# EAGLE design charger (EAGLE 9.6.1)
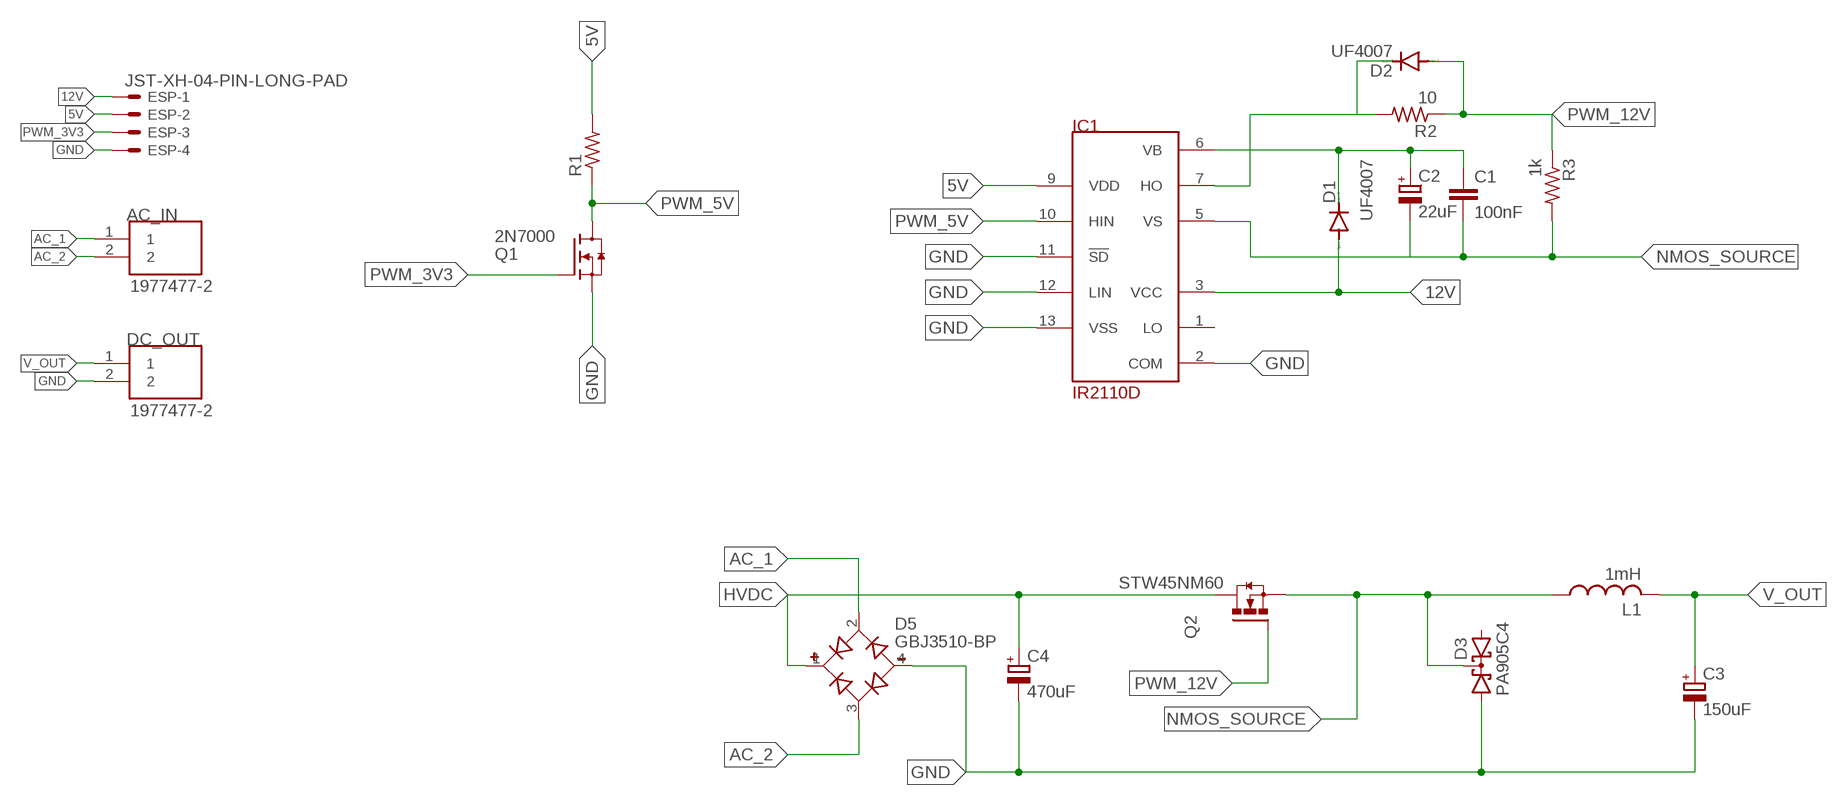
[diagram p0: schematic, sheet 1]

## Parts
AC_IN  1977477-2  [TE_1977477-2]
C1  100nF  C-EU025-025X050  [C025-025X050]
C2  22uF  CPOL-EUE2,5-6E  [E2,5-6E]
C3  150uF  CPOL-EUE7.5-18  [E7,5-18]
C4  470uF  CPOL-EUE10-35  [EB35D]
D1  UF4007  BAS15  [DO34-7]
D2  UF4007  BAS15  [DO34-7]
D3  PA905C4  PBYR3035  [SOT93S]
D5  GBJ3510-BP  [DIOB_GBJ3510-BP]
DC_OUT  1977477-2  [TE_1977477-2]
ESP  JST-XH-04-PIN-LONG-PAD  [JST-XH-04-PACKAGE-LONG-PAD]
IC1  IR2110D  [DIL14]
L1  1mH  L-USTJ7-U1  [TJ7-U1]
Q1  2N7000  [TO92]
Q2  STW45NM60  IRFP240  [TO247AC]
R1  R-US_0204/7  [0204/7]
R2  10  R-US_0204/7  [0204/7]
R3  1k  R-US_0204/7  [0204/7]

## Nets
5V: ESP.2 IC1.9(VDD) R1.2
12V: D1.A ESP.1 IC1.3(VCC)
AC_1: AC_IN.1 D5.2(AC1)
AC_2: AC_IN.2 D5.3(AC2)
GND: C3.- C4.- D3.A1 D5.4(-) DC_OUT.2 ESP.4 IC1.2(COM) IC1.11(!SD) IC1.12(LIN) IC1.13(VSS) Q1.1(S)
HVDC: C4.+ D5.1(+) Q2.2(D)
N$2: D2.C IC1.7(HO) R2.2
NMOS_SOURCE: C1.2 C2.- D3.C IC1.5(VS) L1.1 Q2.3(S) R3.2
PWM_3V3: ESP.3 Q1.2(G)
PWM_5V: IC1.10(HIN) Q1.3(D) R1.1
PWM_12V: D2.A Q2.1(G) R2.1 R3.1
V_OUT: C3.+ DC_OUT.1 L1.2
VB: C1.1 C2.+ D1.C IC1.6(VB)
Unconnected: D3.A2 IC1.1(LO)

## Library data of the parts
AC_IN DC_OUT = terminal_block:1977477-2: Check availability <https://pricing.snapeda.com/parts/1977477-2/TE%20Connectivity/view-part?ref=eda>; AVAILABILITY: In Stock; COMMENT: 1977477-2; DESCRIPTION: Conn Barrier Strip 2 POS 8.25mm Solder ST Thru-Hole 15A/Contact Carton; MF: TE Connectivity; MP: 1977477-2; PACKAGE: None; PRICE: None; PURCHASE-URL: https://pricing.snapeda.com/search/part/1977477-2/?ref=eda
C1 = rcl:C-EU: CAPACITOR, European symbol; SPICEPREFIX: C
C2-C4 = rcl:CPOL-EU: POLARIZED CAPACITOR, European symbol; SPICEPREFIX: C
D1 D2 = diode:BAS15: DIODE high speed
D3 = diode:PBYR3035: Dual DIODE common cathode
D5 = GBJ3510-BP:GBJ3510-BP: Diode Rectifier Bridge Single 1KV 35A 4-Pin(4+Tab) Case GBJ Bulk/Tube Check availability <https://pricing.snapeda.com/parts/GBJ3510-BP/Micro%20Commercial/view-part?ref=eda>; AVAILABILITY: In Stock; DESCRIPTION: Bridge Rectifier Single Phase Standard 1 kV Through Hole GBJ; MF: Micro Commercial; MP: GBJ3510-BP; PACKAGE: SIP-4 Micro Commercial Co; PRICE: None; PURCHASE-URL: https://pricing.snapeda.com/search/part/GBJ3510-BP/?ref=eda
ESP = Rembrandt Electronics - JST XH Connectors v1-0:JST-XH-04-PIN: JST XH Connector 2 Pin Wire to board connector. Pitch: 2,54 mm, (0.100") Number of pins: 4 Created by Rembrandt Electronics www.rembrandtelectronics.com
IC1 = irs:IR2110
L1 = custom_inductor:L-US: INDUCTOR, American symbol; SPICEPREFIX: L
Q1 = 2N7000:2N7000: Check prices <https://pricing.snapeda.com/parts/2N7000/STMicroelectronics/view-part?ref=eda>; AVAILABILITY: In Stock; DESCRIPTION: N-Channel 60V 350mA (Tc) 1W (Tc) Through Hole TO-92-3; MF: STMicroelectronics; MP: 2N7000; PACKAGE: E-PKG AXIAL-LEADED-2 ON Semiconductor; PRICE: None
Q2 = IRFP240(TO-247):IRFP240: MOSFET N-CH 200V 20A TO-247AC Check availability <https://pricing.snapeda.com/parts/IRFP240/Vishay%20Siliconix/view-part?ref=eda>; AVAILABILITY: In Stock; DESCRIPTION: N-Channel 200 V 20A (Tc) 150W (Tc) Through Hole TO-247AC; MF: Vishay Siliconix; MP: IRFP240; PACKAGE: TO-247 Vishay Siliconix; PRICE: None
R1-R3 = rcl:R-US_: RESISTOR, American symbol; SPICEPREFIX: R

## Board
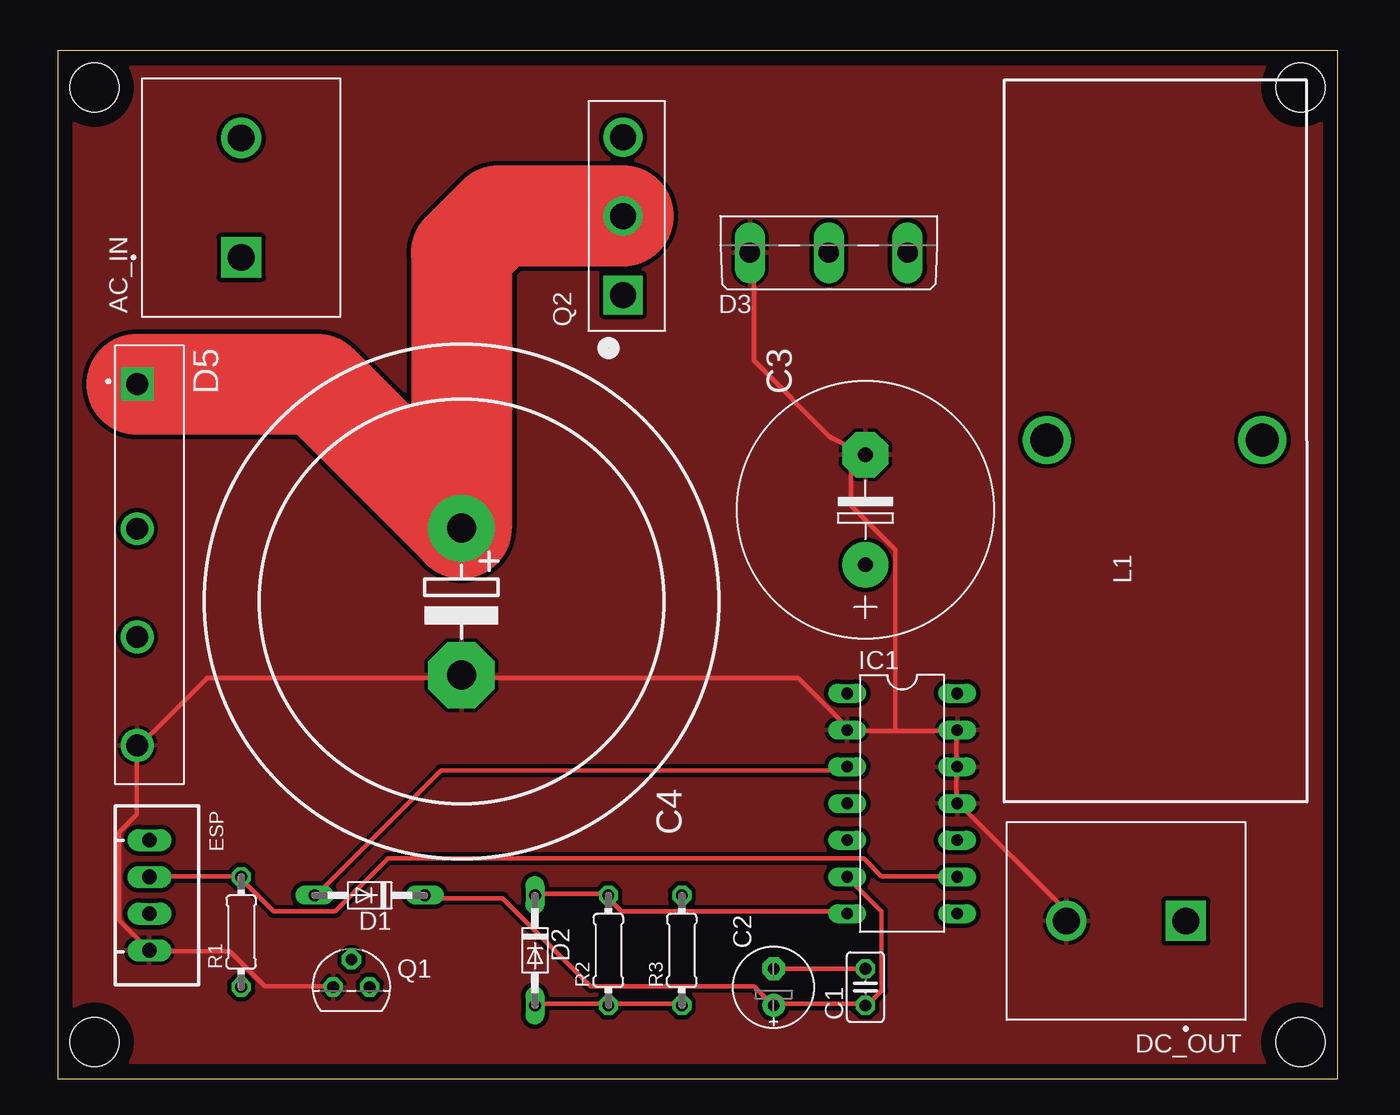
[diagram p1: board, top side]
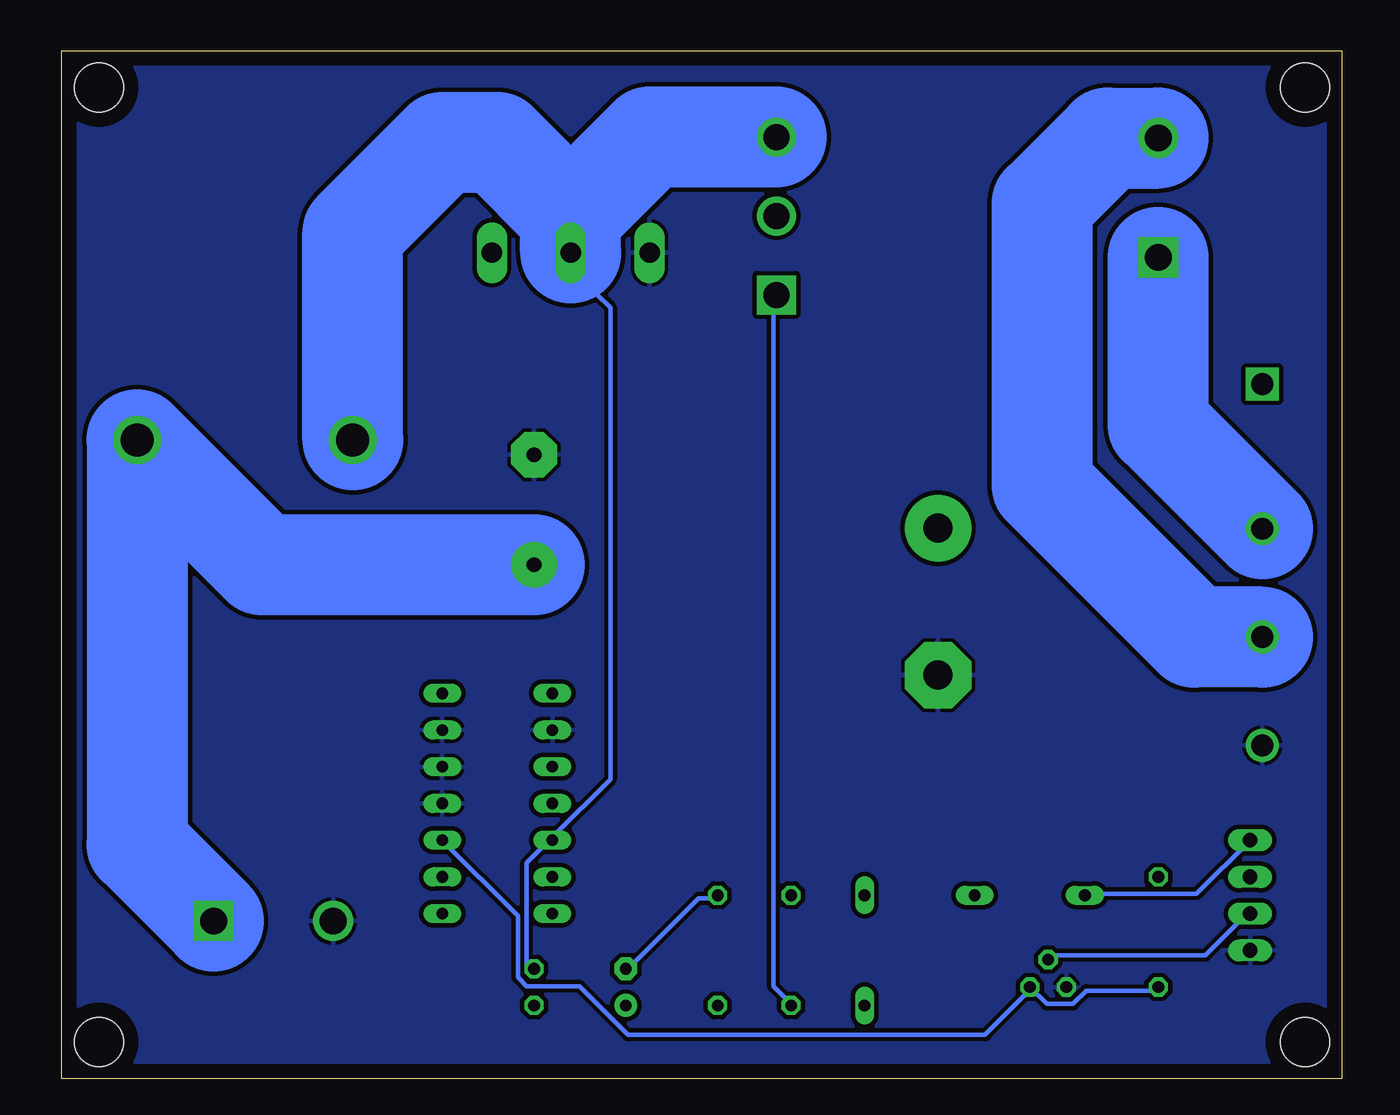
[diagram p2: board, bottom side, seen from below]

Size 88.57 x 71.11 mm. Coordinates in mm from the lower left corner, seen from the top.
Outline: 0,0 88.57,0 88.57,71.11 0,71.11 0,0
Copper layers (1*16): Top 0.035mm / dielectric 1.5mm / Bottom 0.035mm
Design rules "default *": minimum track width 12mil, minimum drill 0.35mm, track to track 12mil, track to pad 12mil, pad to pad 12mil, via to via 12mil, smd to smd 12mil, copper to edge 40mil, drill to drill 6mil, minimum pad ring 10mil, minimum via ring 8mil, stop-mask expansion 4mil, vias tented up to drill 0mil, thermal gap 10mil
Holes 3.4 mm at 2.54,68.58 85.98,68.58 2.54,2.54 85.98,2.54

### Footprints (pad centres in the part's own frame; a part is rotated, then mirrored left to right if it is on the bottom)
TE_1977477-2 = drill 1.85 square: 1 -4.13,0 | drill 1.85: 2 4.13,0
C025-025X050 = drill 0.813 octagon: 1 -1.27,0; 2 1.27,0
E2,5-6E = drill 0.813 pad 1.575: + -1.27,0 | drill 0.813 pad 1.575 octagon: - 1.27,0
E7,5-18 = drill 1.016 pad 3.15: + -3.81,0 | drill 1.016 pad 3.15 octagon: - 3.81,0
EB35D = drill 2.007 pad 4.597: + -5.08,0 | drill 2.007 pad 4.597 octagon: - 5.08,0
DO34-7 = drill 0.813 long: A 3.81,0; C -3.81,0
SOT93S = drill 1.397 long: A1 -5.461,-2.54; A2 5.461,-2.54; C 0,-2.54
DIOB_GBJ3510-BP = drill 1.51 pad 2.27 square: 1 -12.5,-0.85 | drill 1.51 pad 2.27: 2 -2.5,-0.85; 3 5,-0.85; 4 12.5,-0.85
JST-XH-04-PACKAGE-LONG-PAD = drill 1.016 long: 1 -3.81,0; 2 -1.27,0; 3 1.27,0; 4 3.81,0
DIL14 = drill 0.813 long: 1 -7.62,-3.81; 2 -5.08,-3.81; 3 -2.54,-3.81; 4 0,-3.81; 5 2.54,-3.81; 6 5.08,-3.81; 7 7.62,-3.81; 8 7.62,3.81; 9 5.08,3.81; 10 2.54,3.81; 11 0,3.81; 12 -2.54,3.81; 13 -5.08,3.81; 14 -7.62,3.81
TJ7-U1 = drill 2.286: 1 -6.503,4.826; 2 8.408,4.826
TO92 = drill 0.813 octagon: 1 -1.27,0; 2 0,1.905; 3 1.27,0
TO247AC = drill 1.79 pad 2.69 square: 1 -5.46,0.255 | drill 1.79 pad 2.69: 2 0,0.255; 3 5.46,0.255
0204/7 = drill 0.813 octagon: 1 -3.81,0; 2 3.81,0

### Placement (x,y rotation side)
AC_IN  12.7,60.96 90 top
C1  55.88,6.35 90 top
C2  49.53,6.35 90 top
C3  55.88,39.37 90 top
C4  27.94,33.02 270 top
D1  21.59,12.7 180 top
D2  33.02,8.89 270 top
D3  53.34,59.69 0 top
D5  6.35,35.56 270 top
DC_OUT  73.91,10.92 180 top
ESP  6.35,12.7 270 top
IC1  58.42,19.05 270 top
L1  74.93,39.37 0 top
Q1  20.32,6.35 0 top
Q2  39.37,59.69 90 top
R1  12.7,10.16 90 top
R2  38.1,8.89 90 top
R3  43.18,8.89 90 top

### Tracks (layer width: path | path; a pad name or v marks a point on that pad's centre or on a via)
5V
  Top 0.305: ESP.2 6.4,14.02 12.5,14.02 R1.2 12.8,13.72 14.94,11.58 19.2,11.58 22.86,15.24 55.78,15.24 57,14.02 62.18,14.02 IC1.9
12V
  Top 0.305: IC1.3 54.56,21.34 26.52,21.34 17.98,12.8 D1.A
  Bottom 0.305: ESP.1 10.06,12.8 17.68,12.8 D1.A
AC_1
  Bottom 6.985: D5.2 12.7,45.26 AC_IN.1
AC_2
  Bottom 6.985: D5.3 10.24,30.56 20.73,41.05 20.73,60.55 16.19,65.09 AC_IN.2
GND
  Top 0.305: Q1.1 18.9,6.4 14.33,6.4 11.89,8.84 6.4,8.84 ESP.4 4.27,10.97 4.27,17.07 5.49,18.29 5.49,22.86 D5.4 5.79,23.16 10.36,27.74 27.74,27.74 C4.- 28.04,27.74 51.21,27.74 54.56,24.38 IC1.2 54.86,24.08 57.96,24.08 | D3.A1 48.16,57 48.16,49.68 53.44,44.4 C3.- 54.86,42.37 54.86,39.67 57.96,36.58 57.96,24.08 | 62.18,24.08 57.96,24.08 | 62.18,24.08 62.18,21.64 IC1.12 62.18,21.34 62.18,19.2 IC1.11 62.48,18.9 69.49,11.89 69.49,10.97 DC_OUT.2 | 62.18,24.08 IC1.13
  pour Bottom: -1.27,-2.54 90.17,-2.54 91.44,-1.27 91.44,73.66 -2.54,73.66 -2.54,-2.54
  pour Top: -1.27,72.39 90.17,72.39 90.17,-1.27 -1.27,-1.27
HVDC
  Top 6.985: Q2.2 30.48,59.69 27.94,57.15 C4.+ 17.98,48.06 D5.1
N$2
  Top 0.305: D2.C 33.22,12.8 38.1,12.8 R2.2 38.1,12.5 39.01,11.58 54.56,11.58 IC1.7
NMOS_SOURCE
  Top 0.305: C2.- C1.2
  Bottom 0.305: R3.2 43.28,12.5 44.5,12.5 49.38,7.62 C2.- | C1.2 56.08,7.62 56.39,7.92 56.39,14.94 54.86,16.46 IC1.5 54.56,16.76 50.6,20.73 50.6,53.34 51.51,54.25 D3.C
  Bottom 6.985: Q2.3 47.88,65.15 53.34,59.69 | L1.1 68.43,58.57 62.23,64.77 58.42,64.77 53.34,59.69 | D3.C 53.34,59.69
PWM_3V3
  Bottom 0.305: Q1.2 20.12,8.53 9.45,8.53 6.4,11.58 ESP.3
PWM_5V
  Bottom 0.305: R1.1 12.8,6.1 17.68,6.1 18.59,5.18 20.42,5.18 Q1.3 21.64,6.1 24.69,3.05 49.38,3.05 52.73,6.4 56.39,6.4 57,7.01 57,11.28 IC1.10
PWM_12V
  Top 0.305: 38.1,5.18 33.22,5.18 D2.A | 38.1,5.18 42.98,5.18 R3.1 | 38.1,5.18 R2.1
  Bottom 0.305: Q2.1 39.32,53.95 39.32,6.4 38.1,5.18 R2.1
V_OUT
  Bottom 6.985: DC_OUT.1 83.34,16.22 L1.2 74.7,35.56 C3.+
VB
  Top 0.305: D1.C 25.6,12.5 30.79,12.5 36.88,6.4 48.16,6.4 49.38,5.18 C2.+ 49.68,5.18 55.78,5.18 C1.1 56.08,5.18 57,6.1 57,11.58 IC1.6